# Altium schematic sheet Sheet2.SchDoc
size A; SheetNumber: 2; SheetTotal: 2
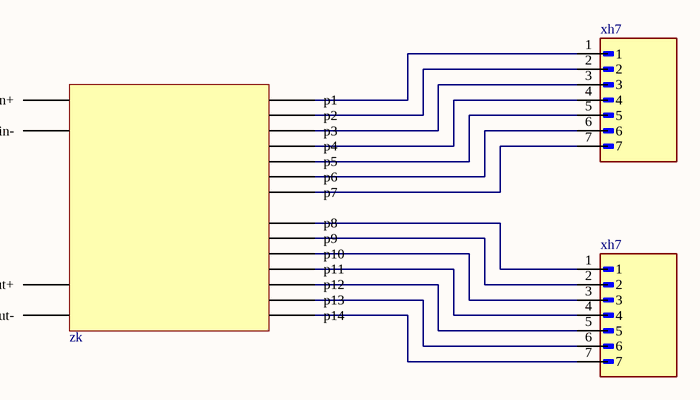
[diagram p0: Sheet2.SchDoc]

## Parts
(Parts that share a designator on the sheet are numbered #1, #2 ... from top to bottom, then left to right.)
xh7#1  S7B-XH-A(LF)(SN)  [JST_S7B-XH-A(LF)(SN)]  (value not drawn)
xh7#2  S7B-XH-A(LF)(SN)  [JST_S7B-XH-A(LF)(SN)]  (value not drawn)
zk  zk  (value not drawn)

## Nets

Not connected (* = marked no-connect by the designer): xh7#1 1 2 3 4 5 6 7; xh7#2 1 2 3 4 5 6 7; zk 61(p1) 62(p2) 63(p3) 64(p4) 65(p5) 66(p6) 67(p7) 68(p14) 69(p13) 70(p12) 71(p11) 72(p10) 73(p9) 74(p8) 75(in+) 76(in-) 77(out+) 78(out-)

## Library data of the parts
xh7#1 xh7#2 = S7B-XH-A(LF)(SN): Connector Header Through Hole, Right Angle 7 position 0.098 (2.50mm); MF: JST Sales; SnapEDA_Link: https://www.snapeda.com/parts/S7B-XH-A(LF)(SN)/JST/view-part/?ref=snap; Package: None; Value: *; MP: S7B-XH-A(LF)(SN); Check_prices: https://www.snapeda.com/parts/S7B-XH-A(LF)(SN)/JST/view-part/?ref=eda